# EAGLE design sed_ethernet (EAGLE 6.3)
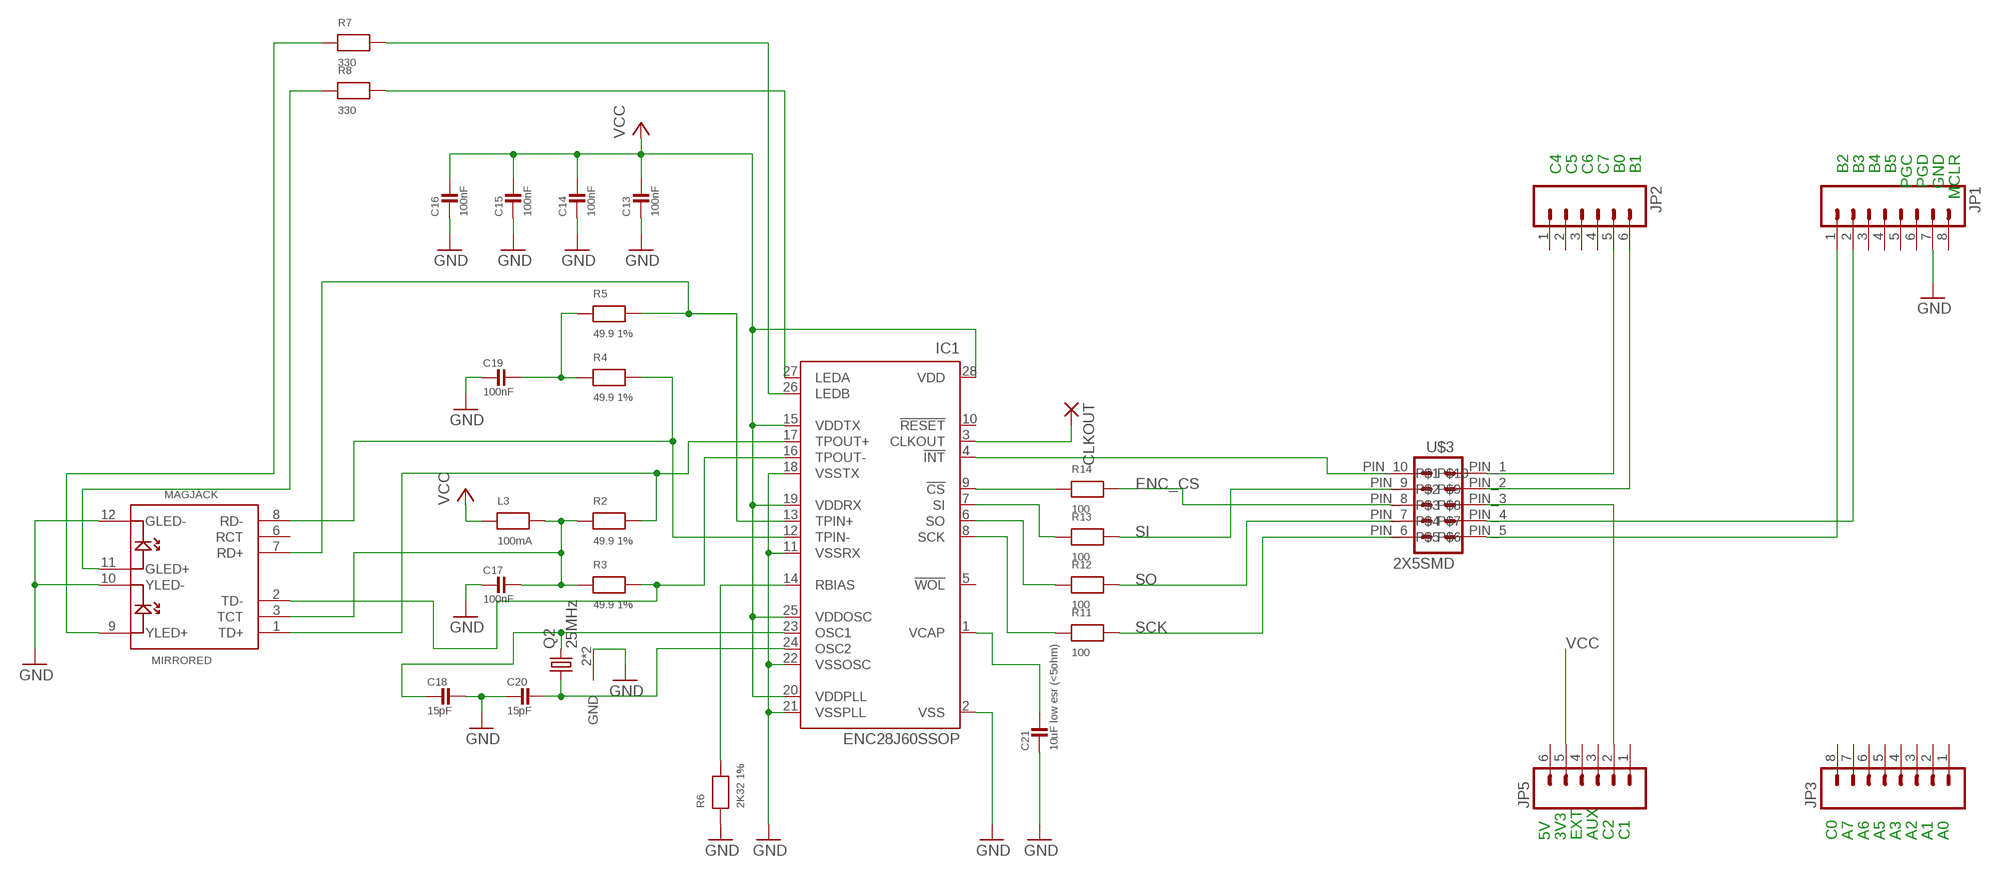
[diagram p0: schematic, sheet 1]

## Parts
C13  100nF  CONDENSADOR-0805  [0805]
C14  100nF  CONDENSADOR-0805  [0805]
C15  100nF  CONDENSADOR-0805  [0805]
C16  100nF  CONDENSADOR-0805  [0805]
C17  100nF  CONDENSADOR-0805  [0805]
C18  15pF  CONDENSADOR-0805  [0805]
C19  100nF  CONDENSADOR-0805  [0805]
C20  15pF  CONDENSADOR-0805  [0805]
C21  10uF low esr (<5ohm)  CONDENSADOR-0805  [0805]
CLKOUT  SMD2  [SMD1,27-2,54]
IC1  ENC28J60SSOP  [SSOP28]
JP1  M08  [1X08]
JP2  M06SIP  [1X06]
JP3  M08  [1X08]
JP5  M06SIP  [1X06]
L3  100mA  RESISTENCIA-0805  [0805]
MIRRORED  MAGJACK  [MAGJACK]
Q2  25MHz  CRYSTAL5X3  [CRYSTAL-SMD-5X3]
R2  49.9 1%  RESISTENCIA-0805  [0805]
R3  49.9 1%  RESISTENCIA-0805  [0805]
R4  49.9 1%  RESISTENCIA-0805  [0805]
R5  49.9 1%  RESISTENCIA-0805  [0805]
R6  2K32 1%  RESISTENCIA-0805  [0805]
R7  330  RESISTENCIA-0805  [0805]
R8  330  RESISTENCIA-0805  [0805]
R11  100  RESISTENCIA-0805  [0805]
R12  100  RESISTENCIA-0805  [0805]
R13  100  RESISTENCIA-0805  [0805]
R14  100  RESISTENCIA-0805  [0805]
U$3  2X5SMD  [2X5SMD]

## Nets
ENC_CS: R14.P$4 U$3.PIN_8
GND: C13.P$3 C14.P$3 C15.P$3 C16.P$3 C17.P$3 C18.P$4 C19.P$3 C20.P$3 C21.P$3 IC1.2(VSS) IC1.11(VSSRX) IC1.18(VSSTX) IC1.21(VSSPLL) IC1.22(VSSOSC) JP1.7 MIRRORED.10(YLED-) MIRRORED.12(GLED-) Q2.2(GND) Q2.4(GND) R6.P$3
N$1: IC1.14(RBIAS) R6.P$4
N$2: IC1.8(SCK) R11.P$3
N$3: IC1.6(SO) R12.P$3
N$4: IC1.7(SI) R13.P$3
N$5: IC1.9(!CS) R14.P$3
N$6: C21.P$4 IC1.1(VCAP)
N$7: IC1.27(LEDA) R8.P$4
N$9: MIRRORED.11(GLED+) R8.P$3
N$13: MIRRORED.9(YLED+) R7.P$3
N$14: IC1.26(LEDB) R7.P$4
N$15: CLKOUT.1(P) IC1.3(CLKOUT)
N$16: IC1.17(TPOUT+) MIRRORED.1(TD+) R2.P$4
N$17: IC1.16(TPOUT-) MIRRORED.2(TD-) R3.P$4
N$18: C17.P$4 L3.P$4 MIRRORED.3(TCT) R2.P$3 R3.P$3
N$19: IC1.13(TPIN+) MIRRORED.7(RD+) R5.P$4
N$20: IC1.12(TPIN-) MIRRORED.8(RD-) R4.P$4
N$21: C19.P$4 R4.P$3 R5.P$3
N$22: C18.P$3 IC1.23(OSC1) Q2.3
N$23: C20.P$4 IC1.24(OSC2) Q2.1
N$24: JP2.5 U$3.PIN_1
N$25: IC1.4(!INT) U$3.PIN_10
N$26: JP5.2 U$3.PIN_3
N$27: JP2.6 U$3.PIN_2
N$28: JP1.2 U$3.PIN_4
N$29: JP1.1 U$3.PIN_5
SCK: R11.P$4 U$3.PIN_6
SI: R13.P$4 U$3.PIN_9
SO: R12.P$4 U$3.PIN_7
VCC: C13.P$4 C14.P$4 C15.P$4 C16.P$4 IC1.15(VDDTX) IC1.19(VDDRX) IC1.20(VDDPLL) IC1.25(VDDOSC) IC1.28(VDD) JP5.5 L3.P$3
Unconnected: IC1.5(!WOL) IC1.10(!RESET) JP1.3 JP1.4 JP1.5 JP1.6 JP1.8 JP2.1 JP2.2 JP2.3 JP2.4 JP3.1 JP3.2 JP3.3 JP3.4 JP3.5 JP3.6 JP3.7 JP3.8 JP5.1 JP5.3 JP5.4 JP5.6 MIRRORED.6(RCT)

## Notes on the sheet
- C4 | C5 | C6 | C7 | B0 | B1 | B2 | B3 | B4 | B5 | PGC | PGD | GND | MCLR
- 5V | 3V3 | EXT | AUX | C2 | C1 | C0 | A7 | A6 | A5 | A3 | A2 | A1 | A0

## Library data of the parts
C13-C21 = hackermesh:CONDENSADOR-0805
CLKOUT = wirepad:SMD2: SMD PAD
IC1 = microchip:ENC28J60: Stand-Alone Ethernet Controller with SPI Interface Source: http://ww1.microchip.com/downloads/en/DeviceDoc/39662c.pdf
JP1 JP3 = SparkFun:M08: Header 8 Standard 8-pin 0.1" header. Use with straight break away headers (SKU : PRT-00116), right angle break away headers (PRT-00553), swiss pins (PRT-00743), machine pins (PRT-00117), and female headers (PRT-00115).
JP2 JP5 = SparkFun:M06: Header 6 Standard 6-pin 0.1" header. Use with straight break away headers (SKU : PRT-00116), right angle break away headers (PRT-00553), swiss pins (PRT-00743), machine pins (PRT-00117), and female headers (PRT-00115). Molex polarized connector foot print use with SKU : PRT-08094 with associated crimp pins and housings. NOTES ON THE VARIANTS LOCK and LOCK_LONGPADS... This footprint was designed to help hold the alignment of a through-hole component (i.e. 6-pin header) while soldering it into place. You may notice that each hole has been shifted either up or down by 0.005 of an inch from it's more standard position (which is a perfectly straight line). This slight alteration caused the pins (the squares in the middle) to touch the edges of the holes. Because they are alternating, it causes a "brace" to hold the component in place. 0.005 has proven to be the perfect amount of "off-center" position when using our standard breakaway headers. Although looks a little odd when you look at the bare footprint, once you have a header in there, the alteration is very hard to notice. Also, if you push a header all the way into place, it is covered up entirely on the bottom side. This idea of altering the position of holes to aid alignment will be further integrated into the Sparkfun Library for other footprints. It can help hold any component with 3 or more connection pins.
L3 R2-R8 R11-R14 = hackermesh:RESISTENCIA-0805: Resistencia en encapsulado 0805
MIRRORED = SparkFun:MAGJACK
Q2 = sed_library:CRYSTAL: Crystals Various standard crystals. Proven footprints. Spark Fun Electronics SKU : COM-00534
U$3 = sed_library:2X5SMD

## Board
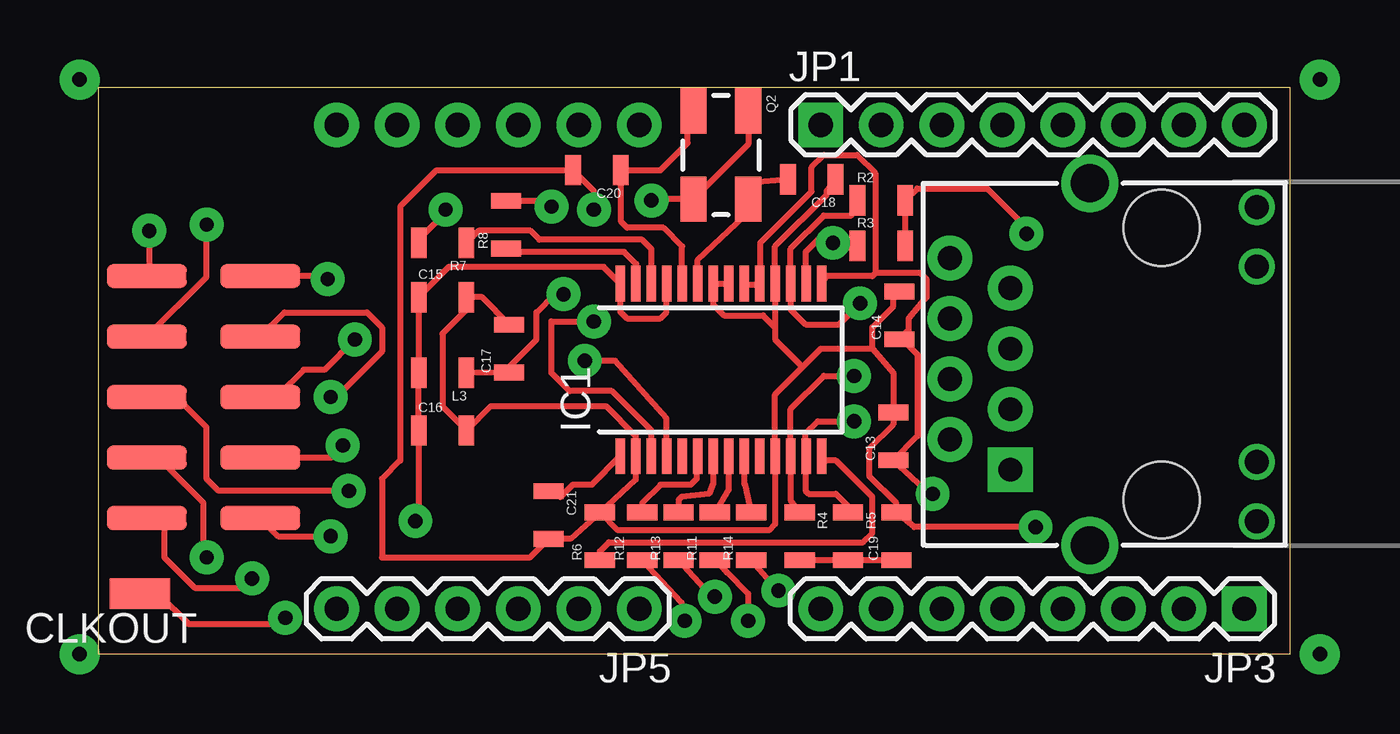
[diagram p1: board, top side]
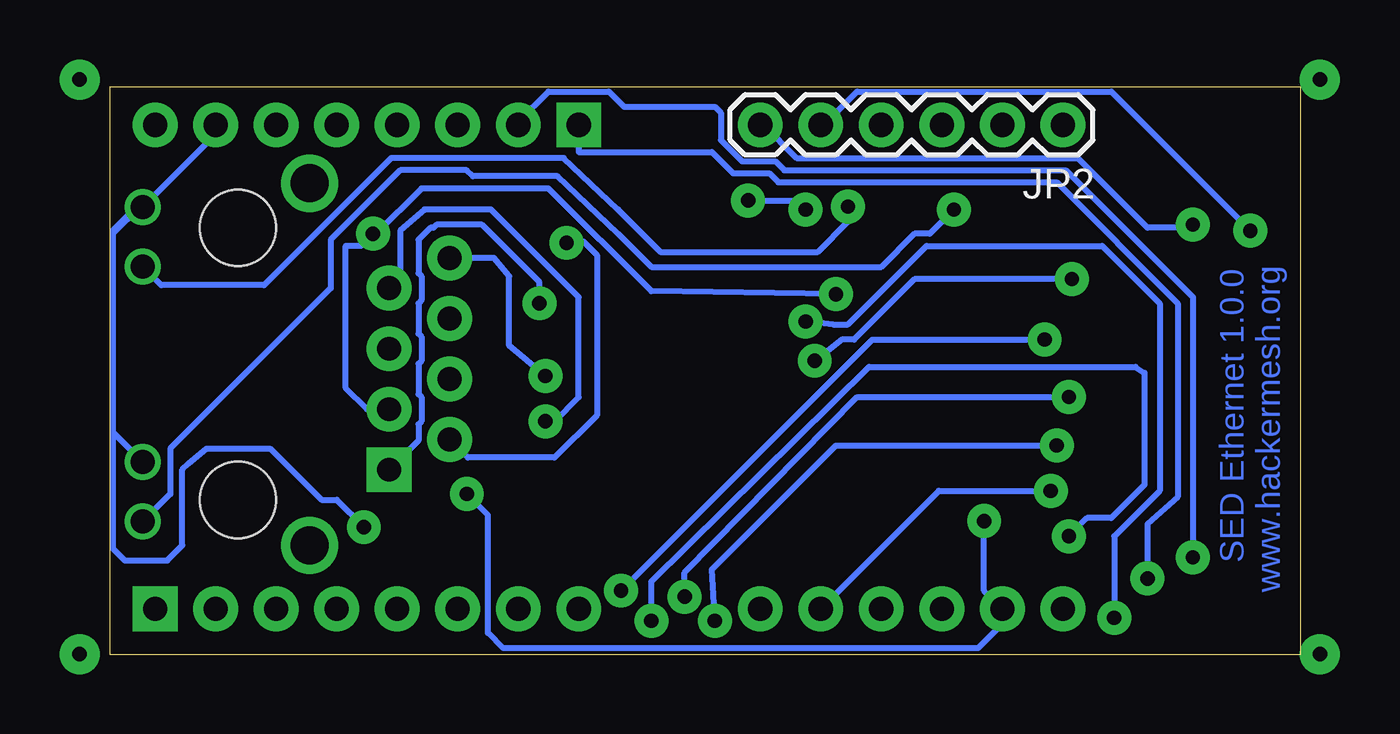
[diagram p2: board, bottom side, seen from below]

Size 50 x 23.8 mm. Coordinates in mm from the lower left corner, seen from the top.
Outline: 50,0 0,0 0,23.8 50,23.8 50,0
Copper layers (1*16): Top 0.035mm / dielectric 1.5mm / Bottom 0.035mm
Design rules "default": minimum track width 10mil, minimum drill 24mil, track to track 8mil, track to pad 8mil, pad to pad 8mil, via to via 8mil, smd to smd 8mil, copper to edge 40mil, drill to drill 8mil, minimum pad ring 10mil, minimum via ring 8mil, stop-mask expansion 4mil, vias tented up to drill 0mil, thermal gap 10mil

### Footprints (pad centres in the part's own frame; a part is rotated, then mirrored left to right if it is on the bottom)
0805 = smd 1.27 x 0.66: P$3 0,1; P$4 0,-1
SMD1,27-2,54 = smd 1.27 x 2.54: 1 0,0
SSOP28 = smd 0.4 x 1.5: 1 -4.225,-3.625; 2 -3.575,-3.625; 3 -2.925,-3.625; 4 -2.275,-3.625; 5 -1.625,-3.625; 6 -0.975,-3.625; 7 -0.325,-3.625; 8 0.325,-3.625; 9 0.975,-3.625; 10 1.625,-3.625; 11 2.275,-3.625; 12 2.925,-3.625; 13 3.575,-3.625; 14 4.225,-3.625; 15 4.225,3.625; 16 3.575,3.625; 17 2.925,3.625; 18 2.275,3.625; 19 1.625,3.625; 20 0.975,3.625; 21 0.325,3.625; 22 -0.325,3.625; 23 -0.975,3.625; 24 -1.625,3.625; 25 -2.275,3.625; 26 -2.925,3.625; 27 -3.575,3.625; 28 -4.225,3.625
1X08 = drill 1.016 pad 1.88 square: 1 0,0 | drill 1.016 pad 1.88: 2 2.54,0; 3 5.08,0; 4 7.62,0; 5 10.16,0; 6 12.7,0; 7 15.24,0; 8 17.78,0
1X06 = drill 1.016 pad 1.88: 1 0,0; 2 2.54,0; 3 5.08,0; 4 7.62,0; 5 10.16,0; 6 12.7,0
MAGJACK = drill 1 pad 1.88 square: 1 3.175,17.445 | drill 1 pad 1.88: 2 4.445,19.985; 3 5.715,17.445; 4 6.985,19.985; 5 8.255,17.445; 6 9.525,19.985; 7 10.795,17.445; 8 12.065,19.985 | drill 1 pad 1.27: 9 1,7.1; 10 3.5,7.1; 11 11.7,7.1; 12 14.2,7.1 | drill 1.6 pad 2.184: M1 0,14.1; M2 15.2,14.1 | hole 3.2: 1.905,11.095; 13.335,11.095
CRYSTAL-SMD-5X3 = smd 1.9 x 1.1: 1 -1.85,-1.15; 2 1.85,-1.15; 3 1.85,1.15; 4 -1.85,1.15
2X5SMD = smd 3.353 x 1: PIN_1 -2.379,5.08; PIN_2 -2.379,2.54; PIN_3 -2.379,0; PIN_4 -2.379,-2.54; PIN_5 -2.379,-5.08; PIN_6 2.379,-5.08; PIN_7 2.379,-2.54; PIN_8 2.379,0; PIN_9 2.379,2.54; PIN_10 2.379,5.08

### Placement (x,y rotation side)
C13  33.36,9.14 0 top
C14  33.62,14.22 0 top
C15  14.44,14.99 270 top
C16  14.44,9.4 270 top
C17  17.23,12.83 0 top
C18  29.93,19.94 90 top
C19  33.49,4.95 0 top
C20  20.92,20.32 90 top
C21  18.88,5.84 180 top
CLKOUT  1.74,2.54 90 top
IC1  26.12,11.94 0 top
JP1  30.31,22.23 0 top
JP2  10,22.23 180 bottom
JP3  48.09,1.91 180 top
JP5  22.69,1.91 180 top
L3  14.44,11.81 90 top
MIRRORED  55.72,4.57 90 top
Q2  26.12,20.95 270 top
R2  32.85,19.05 270 top
R3  32.85,17.14 270 top
R4  29.43,4.95 180 top
R5  31.46,4.95 180 top
R6  21.04,4.95 0 top
R7  14.44,17.27 90 top
R8  17.11,18.03 0 top
R11  25.87,4.95 0 top
R12  22.82,4.95 0 top
R13  24.35,4.95 0 top
R14  27.39,4.95 0 top
U$3  4.41,10.79 0 top

### Tracks (layer width: path | path; a pad name or v marks a point on that pad's centre or on a via)
ENC_CS  (via drill 0.6 pad 1.42)
  Top 0.254: R14.P$4 v28.54,2.67 | v10.76,13.21 9.49,11.94 8.6,11.94 7.58,10.92 7.46,10.92 7.33,10.79 U$3.PIN_8
  Bottom 0.254: v28.54,2.67 18,13.21 v10.76,13.21
GND  (via drill 0.6 pad 1.42)
  Top 0.254: R6.P$3 22.55,7.33 IC1.2 22.55,9.16 21.3,10.41 16.46,10.41 C16.P$3 | 29.55,12.06 28.4,10.91 IC1.11 28.4,5.45 28.16,5.21 21.79,5.21 R6.P$3 | 29.55,12.06 30.31,12.83 32.47,12.83 | 32.47,12.83 33.36,11.81 C13.P$3 33.36,9.65 32.35,8.64 32.35,7.49 33.49,6.35 C19.P$3 34.24,5.33 v39.33,5.33 | 32.47,12.83 32.47,13.72 33.36,14.61 33.36,14.97 C14.P$3 | 28.4,13.72 IC1.18 28.4,17.13 30.57,19.3 30.57,19.45 C18.P$4 | 28.4,13.72 28.4,13.22 29.55,12.06 | IC1.21 IC1.22 25.8,14.68 26.25,14.22 27.89,14.22 28.4,13.72 | 15.46,9.4 C16.P$3 | 16.09,14.99 16.11,14.99 C17.P$3 17.23,13.84 16.09,14.99 | 15.46,14.99 C15.P$3 | R6.P$3 19.81,4.84 C21.P$3 | 18.61,4.84 C21.P$3 | 16.09,14.99 15.46,14.99 | 15.46,14.99 15.46,14.48 14.44,13.46 14.44,10.4 C16.P$3 | C21.P$3 18.11,4.06 11.9,4.06 11.9,7.37 12.66,8.13 12.66,18.8 14.19,20.32 C20.P$3 20.79,19.45 v20.79,18.67 | v23.2,19.05 23.64,19.11 Q2.2 27.27,21.41 Q2.4
  Bottom 0.254: 49.87,17.65 49.87,17.78 48.88,18.77 MIRRORED.12 45.55,21.83 JP1.7 45.55,21.84 48.6,18.8 48.73,18.8 49.87,17.65 | 49.87,17.65 49.87,9.33 | 49.87,9.33 MIRRORED.10 | 49.87,9.33 49.87,4.45 49.37,3.94 47.59,3.94 46.95,4.57 46.95,7.75 46.7,8 45.94,8.64 43.27,8.64 41.11,6.48 40.48,6.48 v39.33,5.33 | v23.2,19.05 21.17,19.05 v20.79,18.67
N$1
  Top 0.254: R6.P$4 21.04,4.32 21.42,4.7 32.09,4.7 32.47,5.08 32.47,6.6 30.95,8.13 30.53,8.13 IC1.14
N$2
  Top 0.254: IC1.8 26.45,6.91 R11.P$3
N$3
  Top 0.254: IC1.6 25.11,8.31 25.11,7.37 24.85,7.11 23.58,7.11 22.82,6.35 R12.P$3
N$4
  Top 0.254: IC1.7 25.8,7.17 25.62,6.73 24.47,6.6 24.35,6.48 R13.P$3
N$5
  Top 0.254: IC1.9 27.1,7.15 27.14,7.11 R14.P$3
N$6
  Top 0.254: IC1.1 20.7,7.11 19.9,7.11 19.38,6.59 C21.P$4
N$7
  Top 0.254: IC1.27 22.57,15.58 22.57,16.38 22.06,16.89 17.11,16.89 R8.P$4
N$8  (via drill 0.6 pad 1.68)
  other vias: -0.8,24.13
N$9  (via drill 0.6 pad 1.42)
  Top 0.254: R8.P$3 18.77,19.03 v19.01,18.8
  Bottom 0.254: MIRRORED.11 47.84,15.49 43.52,15.49 38.19,20.83 30.95,20.83 28.66,18.67 26.89,16.89 20.28,16.89 19.01,18.16 v19.01,18.8
N$10  (via drill 0.6 pad 1.68)
  other vias: 51.27,24.13
N$11  (via drill 0.6 pad 1.68)
  other vias: 51.27,0
N$12  (via drill 0.6 pad 1.68)
  other vias: -0.8,0
N$13  (via drill 0.6 pad 1.42)
  Top 0.254: R7.P$3 13.42,17.4 14.69,18.67 v14.57,18.67
  Bottom 0.254: MIRRORED.9 47.46,6.73 47.46,8.64 40.73,15.37 40.73,17.4 37.81,20.32 35.01,20.32 34.76,20.07 31.2,20.07 28.66,17.65 27.27,16.26 17.61,16.26 16.22,17.65 15.58,17.65 v14.57,18.67
N$14
  Top 0.254: IC1.26 23.2,17.02 22.82,17.4 18.5,17.4 18.12,17.78 15.95,17.78 R7.P$4
N$15  (via drill 0.6 pad 1.42)
  Top 0.254: IC1.3 23.2,9.4 21.55,11.05 19.77,11.05 19.01,11.81 19.01,13.97 v20.79,13.97 | CLKOUT.1 2.5,2.54 3.77,1.27 7.58,1.27 v7.84,1.52
  Bottom 0.254: v7.84,1.52 7.84,4.95 5.93,6.86 5.93,14.73 8.34,17.14 15.71,17.14 19.01,13.84 19.65,13.84 v20.79,13.97
N$16  (via drill 0.6 pad 1.42)
  Top 0.254: R2.P$4 31.6,18.41 30.44,18.41 29.05,17.02 IC1.17 29.05,14.47 29.68,13.84 31.08,13.84 v31.97,14.73
  Bottom 0.254: v31.97,14.73 31.97,15.62 34.38,18.03 36.28,18.03 36.41,17.91 36.54,17.91 37.05,17.4 37.05,16 36.92,15.88 36.92,14.86 37.05,14.73 37.05,13.46 36.92,13.34 36.92,12.32 37.05,12.19 37.05,10.92 36.92,10.79 36.92,9.78 37.05,9.65 37.05,8.97 MIRRORED.1
N$17  (via drill 0.6 pad 1.42)
  Top 0.254: R3.P$4 31.84,16.76 | 31.84,16.76 31.2,17.4 v30.82,17.27 30.19,17.4 29.68,16.89 29.68,15.67 IC1.16 | 31.84,16.76 31.71,16.76
  Bottom 0.254: 35.6,8.89 MIRRORED.2 34.97,8.26 31.33,8.26 29.55,10.03 29.55,16.76 30.12,17.34 30.63,17.34 v30.82,17.27
N$18  (via drill 0.6 pad 1.42)
  Top 0.254: R3.P$3 R2.P$3 34.36,19.56 37.3,19.56 38.95,17.91 v38.95,17.65 | L3.P$4 C17.P$4 17.23,12.06 18.38,13.21 18.38,14.35 19.14,15.11 v19.52,15.11
  Bottom 0.254: MIRRORED.3 39.21,10.29 40.09,11.18 40.09,17.14 39.46,17.14 v38.95,17.65 38.82,17.65 36.92,19.56 31.58,19.56 27.27,15.24 v19.52,15.11
N$19  (via drill 0.6 pad 1.42)
  Top 0.254: v31.71,9.78 30.19,9.78 29.68,9.27 29.68,8.33 arc90 IC1.13 29.68,8.29 29.68,6.86 29.81,6.73 30.95,6.73 31.46,6.22 R5.P$4
  Bottom 0.254: v31.71,9.78 31.33,9.78 30.31,10.79 30.31,14.99 34,18.67 36.79,18.67 37.81,17.78 37.81,15.83 MIRRORED.7
N$20  (via drill 0.6 pad 1.42)
  Top 0.254: R4.P$4 29.05,6.46 IC1.12 29.05,10.29 30.44,11.68 v31.71,11.68
  Bottom 0.254: v31.71,11.68 33.24,12.95 33.24,15.88 33.87,16.64 MIRRORED.8
N$21
  Top 0.254: R4.P$3 R5.P$3 C19.P$4
N$22
  Top 0.254: IC1.23 25.15,16.55 27.14,18.41 27.52,18.92 27.39,18.92 | 27.39,18.92 27.41,19.81 C18.P$3 | 27.39,18.92 27.27,19.04 Q2.3
N$23
  Top 0.254: IC1.24 24.5,17.12 23.71,17.91 22.19,17.91 21.93,18.16 21.93,20.3 C20.P$4 23.58,20.32 24.73,21.46 24.73,22.56 Q2.1
N$24  (via drill 0.6 pad 1.42)
  Top 0.254: v2.12,17.78 2.12,15.97 U$3.PIN_1
  Bottom 0.254: JP2.5 20.15,22.1 18.63,23.62 7.96,23.62 v2.12,17.78
N$25  (via drill 0.6 pad 1.42)
  Top 0.254: IC1.4 23.84,8.32 23.84,9.91 21.68,12.32 v20.41,12.32 | v9.61,15.75 9.49,15.88 U$3.PIN_10
  Bottom 0.254: v9.61,15.75 16.22,15.75 18.76,13.21 19.27,13.21 v20.41,12.32
N$26  (via drill 0.6 pad 1.42)
  Top 0.254: v10.5,6.86 5.04,6.86 4.53,7.37 4.53,9.53 3.26,10.79 U$3.PIN_3
  Bottom 0.254: JP5.2 15.2,6.86 v10.5,6.86
N$27  (via drill 0.6 pad 1.42)
  Top 0.254: U$3.PIN_2 4.53,15.84 v4.53,18.03
  Bottom 0.254: v4.53,18.03 4.66,17.91 6.44,17.91 9.36,20.83 21.17,20.83 22.57,22.23 JP2.6
N$28  (via drill 0.6 pad 1.42)
  Top 0.254: v4.53,4.06 4.41,4.32 4.41,6.35 2.88,7.87 2.41,7.87 U$3.PIN_4
  Bottom 0.254: JP1.2 32.85,22.35 31.58,23.62 29.04,23.62 28.41,22.99 24.6,22.99 24.35,22.73 24.35,21.59 23.46,20.7 22.06,20.7 21.68,20.32 9.87,20.32 4.53,14.99 v4.53,4.06
N$29  (via drill 0.6 pad 1.42)
  Top 0.254: U$3.PIN_5 2.76,5.71 2.76,4.06 4.03,2.79 6.06,2.79 v6.44,3.17
  Bottom 0.254: JP1.1 30.31,21.08 24.73,21.08 23.84,20.19 22.31,20.19 21.93,19.81 10.25,19.81 5.17,14.73 5.17,6.6 6.44,5.46 v6.44,3.17
SCK  (via drill 0.6 pad 1.42)
  Top 0.254: v27.27,1.4 27.27,2.54 26.38,3.43 26.27,3.56 R11.P$4 | U$3.PIN_6 7.55,4.95 v9.74,4.95
  Bottom 0.254: v27.27,1.4 27.27,3.05 18.12,12.06 6.95,12.06 6.57,11.81 6.57,7.11 7.96,5.71 8.98,5.71 v9.74,4.95
SI  (via drill 0.6 pad 1.42)
  Top 0.254: R13.P$4 25.62,2.56 v25.87,2.41 | U$3.PIN_9 7.8,14.35 11.27,14.35 11.9,13.72 11.9,12.7 10,10.79 v9.74,10.79
  Bottom 0.254: v9.74,10.79 18.63,10.79 25.87,3.43 v25.87,2.41
SO  (via drill 0.6 pad 1.42)
  Top 0.254: R12.P$4 24.47,2.17 v24.6,1.4 | U$3.PIN_7 9.74,8.26 v10.25,8.76
  Bottom 0.254: v10.25,8.76 19.52,8.76 24.73,3.56 v24.6,1.4
VCC  (via drill 0.6 pad 1.42)
  Top 0.254: C14.P$4 33.49,13.21 33.74,13.21 34.38,12.57 34.38,9.16 C13.P$4 34.9,6.73 v35.01,6.73 | IC1.19 27.71,15.56 | 27.71,15.56 27.65,15.62 | 27.71,15.56 27.77,15.49 | 27.77,15.49 27.17,15.49 IC1.20 | 27.77,15.49 27.77,17.27 29.93,19.43 29.93,20.45 30.44,20.95 31.84,20.95 32.6,20.19 32.6,16 | 32.6,16 32.47,15.88 30.54,15.88 IC1.15 | C14.P$4 34.01,13.22 | 32.6,16 34.51,16 34.76,15.75 34.76,14.99 34,14.1 34,13.61 C14.P$4 | v13.3,5.59 13.42,5.95 C16.P$4 L3.P$3 C15.P$4 13.44,15 14.69,16.26 21.21,16.26 IC1.28 21.9,14.38 22.19,14.1 23.58,14.1 23.84,14.35 23.84,15.55 IC1.25
  Bottom 0.254: v35.01,6.73 34.12,5.84 34.12,0.89 33.49,0.25 13.55,0.25 12.54,1.27 JP5.5 13.3,2.67 v13.3,5.59

### Text on the board
Bottom: www.hackermesh.org | SED Ethernet 1.0.0